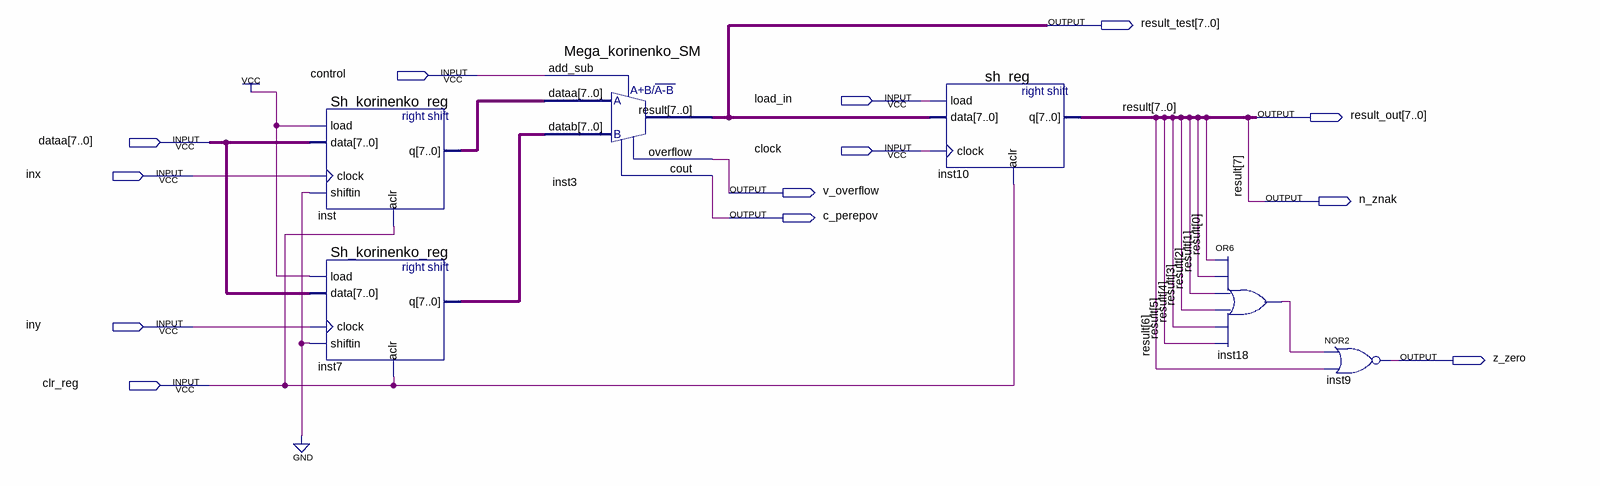
[diagram p0: schematic sheet]
// Quartus schematic megasum_korinenko_sm.bdf as structural Verilog: 6 symbols, 13 pins
module megasum_korinenko_sm (
  input  control,
  input  load_in,
  input  [7:0] dataa,
  input  clock,
  input  inx,
  input  iny,
  input  clr_reg,
  output [7:0] result_test,
  output [7:0] result_out,
  output v_overflow,
  output n_znak,
  output c_perepov,
  output z_zero
);

  wire inst18_out;
  wire [7:0] inst7_q, inst_q;

  Sh_korinenko_reg inst (.load(1'b1), .data(dataa), .clock(inx), .shiftin(1'b0), .aclr(clr_reg), .q(inst_q));
  Sh_korinenko_reg inst7 (.load(1'b1), .data(dataa), .clock(iny), .shiftin(1'b0), .aclr(clr_reg), .q(inst7_q));
  Mega_korinenko_SM inst3 (
    .dataa(inst_q), .datab(inst7_q), .add_sub(control), .result(result_test), .overflow(v_overflow),
    .cout(c_perepov));
  sh_reg inst10 (.load(load_in), .data(result_test), .clock(clock), .aclr(clr_reg), .q({n_znak, result_out[6:0]}));
  or inst18 (inst18_out, result_out[0], result_out[1], result_out[2], result_out[3], result_out[4], result_out[5]);
  nor inst9 (z_zero, inst18_out, result_out[6]);

  assign result_out[7] = n_znak;

  // Other names for the same wires on the sheet: result[7:0] = {n_znak, result_out[6:0]}
endmodule
